# EAGLE schematic PWM sheild lilyGO (EAGLE 9.6.2)
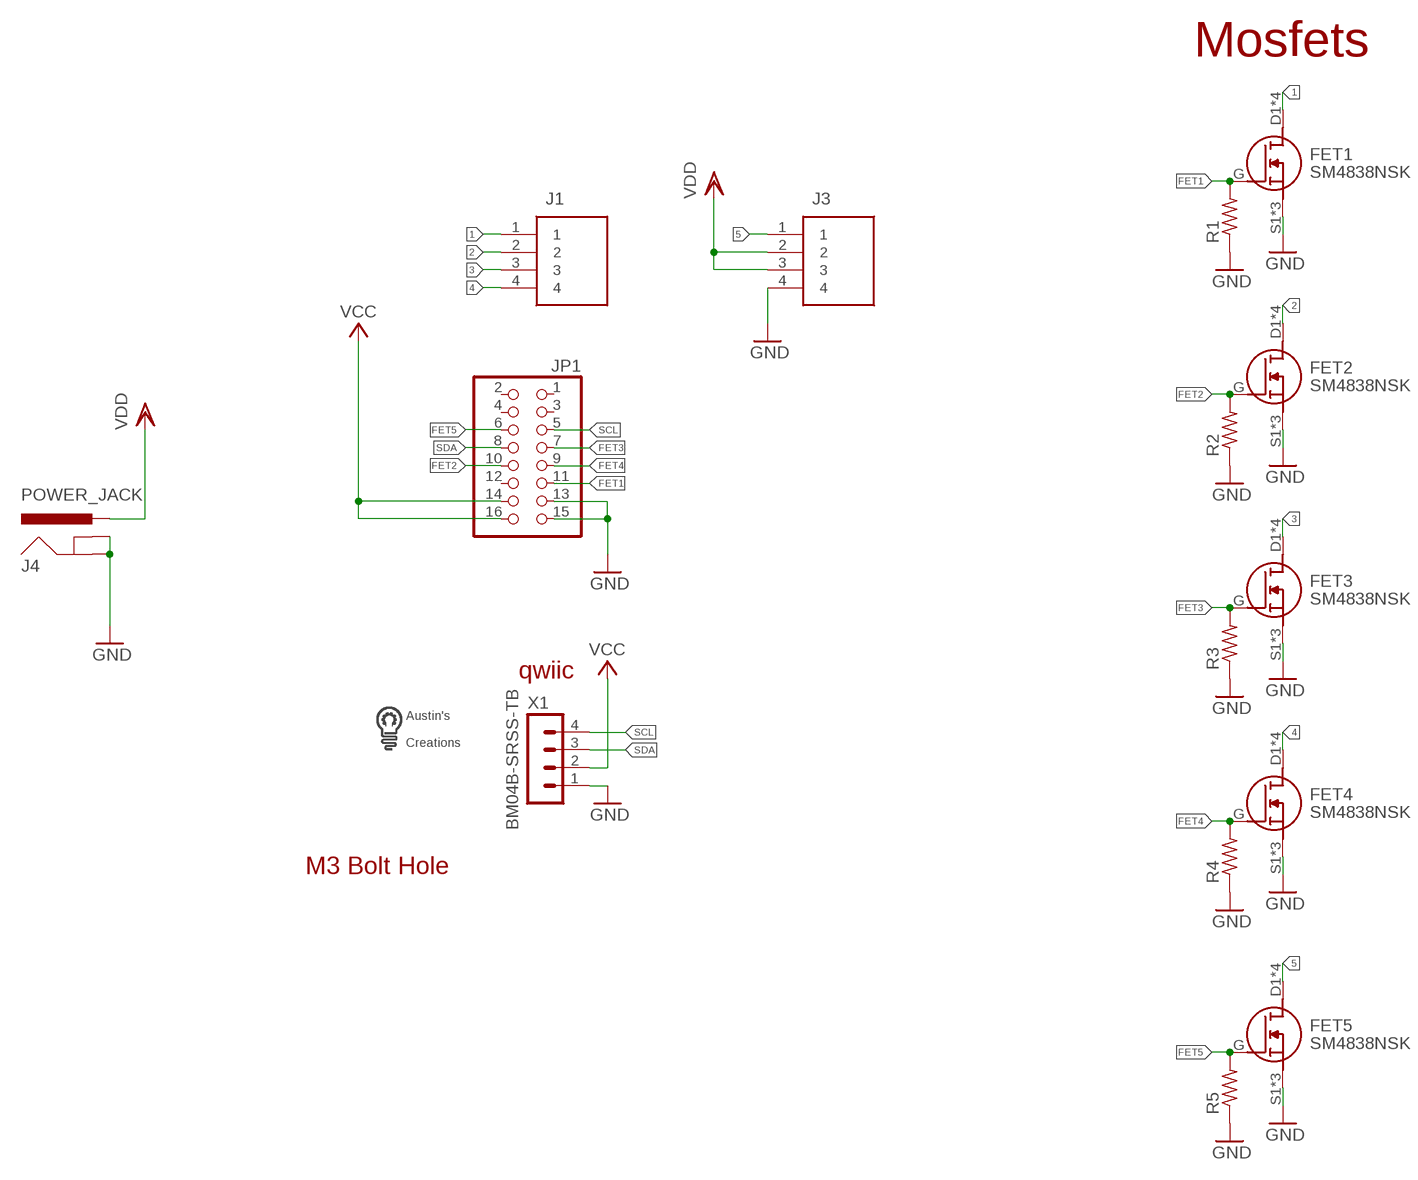
[diagram p0: schematic, sheet 1]

## Parts
FET1  SM4838NSK  [SM4838NSK]
FET2  SM4838NSK  [SM4838NSK]
FET3  SM4838NSK  [SM4838NSK]
FET4  SM4838NSK  [SM4838NSK]
FET5  SM4838NSK  [SM4838NSK]
J1  SCREWTERMINAL-4P-5MM  [SCREWTERMINAL-4P-5MM]
J3  SCREWTERMINAL-4P-5MM  [SCREWTERMINAL-4P-5MM]
J4  POWER_JACK  [POWER_JACK_PTH]
JP1  PINHD-2X8  [2X08]
R1  R-US_R0603  [R0603]
R2  R-US_R0603  [R0603]
R3  R-US_R0603  [R0603]
R4  R-US_R0603  [R0603]
R5  R-US_R0603  [R0603]
U$1  M3BOLTHOLE  [M3BOLTHOLE]
U$2  LOGO  [LOGO]
X1  BM04B-SRSS-TB  [BM04B-SRSS-TB]

## Nets
1: FET1.D1(D) FET1.D2(D) FET1.D3(D) FET1.D4(D) J1.1
2: FET2.D1(D) FET2.D2(D) FET2.D3(D) FET2.D4(D) J1.2
3: FET3.D1(D) FET3.D2(D) FET3.D3(D) FET3.D4(D) J1.3
4: FET4.D1(D) FET4.D2(D) FET4.D3(D) FET4.D4(D) J1.4
5: FET5.D1(D) FET5.D2(D) FET5.D3(D) FET5.D4(D) J3.1
FET1: FET1.G JP1.11 R1.2
FET2: FET2.G JP1.10 R2.2
FET3: FET3.G JP1.7 R3.2
FET4: FET4.G JP1.9 R4.2
FET5: FET5.G JP1.6 R5.2
GND: FET1.S1(S) FET1.S2(S) FET1.S3(S) FET2.S1(S) FET2.S2(S) FET2.S3(S) FET3.S1(S) FET3.S2(S) FET3.S3(S) FET4.S1(S) FET4.S2(S) FET4.S3(S) FET5.S1(S) FET5.S2(S) FET5.S3(S) J3.4 J4.GND J4.GNDBREAK JP1.13 JP1.15 R1.1 R2.1 R3.1 R4.1 R5.1 X1.1
SCL: JP1.5 X1.4
SDA: JP1.8 X1.3
VCC: JP1.14 JP1.16 X1.2
VDD: J3.2 J3.3 J4.PWR
Unconnected: JP1.1 JP1.2 JP1.3 JP1.4 JP1.12

## Notes on the sheet
- Mosfets
- qwiic

## Library data of the parts
FET1-FET5 = custom parts:SM4838NSK: N channel mosfet 30v 10a SOP-8
J1 J3 = SamacSys_Parts:SCREWTERMINAL-4P-5MM: Fixed Terminal Blocks Terminal block, screw type, 5.00, horizontal, 4 poles, CUI Blue, slotted screw, PCB mount Source: Datasheet <https://componentsearchengine.com/Datasheets/1/TB001-500-04BE.pdf>; DESCRIPTION: Fixed Terminal Blocks Terminal block, screw type, 5.00, horizontal, 4 poles, CUI Blue, slotted screw, PCB mount; HEIGHT: 12.9mm; MANUFACTURER_NAME: CUI Inc.; MANUFACTURER_PART_NUMBER: TB001-500-04BE; MOUSER_PART_NUMBER: 490-TB001-500-04BE; MOUSER_PRICE-STOCK: https://www.mouser.co.uk/ProductDetail/CUI-Devices/TB001-500-04BE?qs=vLWxofP3U2xFd1xqNcHXZA%3D%3D
J4 = custom parts:POWER_JACK: Power Jack Connector This is the standard 5.5mm barrel jack for power. The PTH is the most common, proven, reliable, footprint. The Slot footprint only works if the mill layer is transmitted to the PCB fab house so be warned. Here are the connectors we sell at SparkFun: DC Barrel Power Jack/Connector <https://www.sparkfun.com/products/119> (PRT-00119) DC Barrel Power Jack/Connector (SMD) <https://www.sparkfun.com/products/12748> (PRT-12748) DC Barrel Jack Adapter - Breadboard Compatible <https://www.sparkfun.com/products/10811> (PRT-10811) It is used on this SparkFun product (and many, many others): SparkFun RedBoard - Programmed with Arduino <https://www.sparkfun.com/products/12757> (DEV-12757) Also, if you need a mating power supply or connector, please check these out: Wall Adapter Power Supply - 9VDC 650mA <https://www.sparkfun.com/products/298> (TOL-00298) DC Barrel Jack Adapter - Male <https://www.sparkfun.com/products/10287> (PRT-10287); PROD_ID: CONN-08197
JP1 = pinhead:PINHD-2X8: PIN HEADER
R1-R5 = rcl:R-US_: RESISTOR, American symbol; SPICEPREFIX: R
U$1 = custom parts:M3BOLTHOLE
U$2 = custom parts:LOGO
X1 = custom parts:BM04B-SRSS: JST SH series header 1.00mm pitch disconnectable crimp style connectors, vertical (side entry type), 4 pins